# Altium schematic sheet SCH_InfoBar-(ESP8266-12F)_2024-08-24.schdoc
size 602 x 314 mm
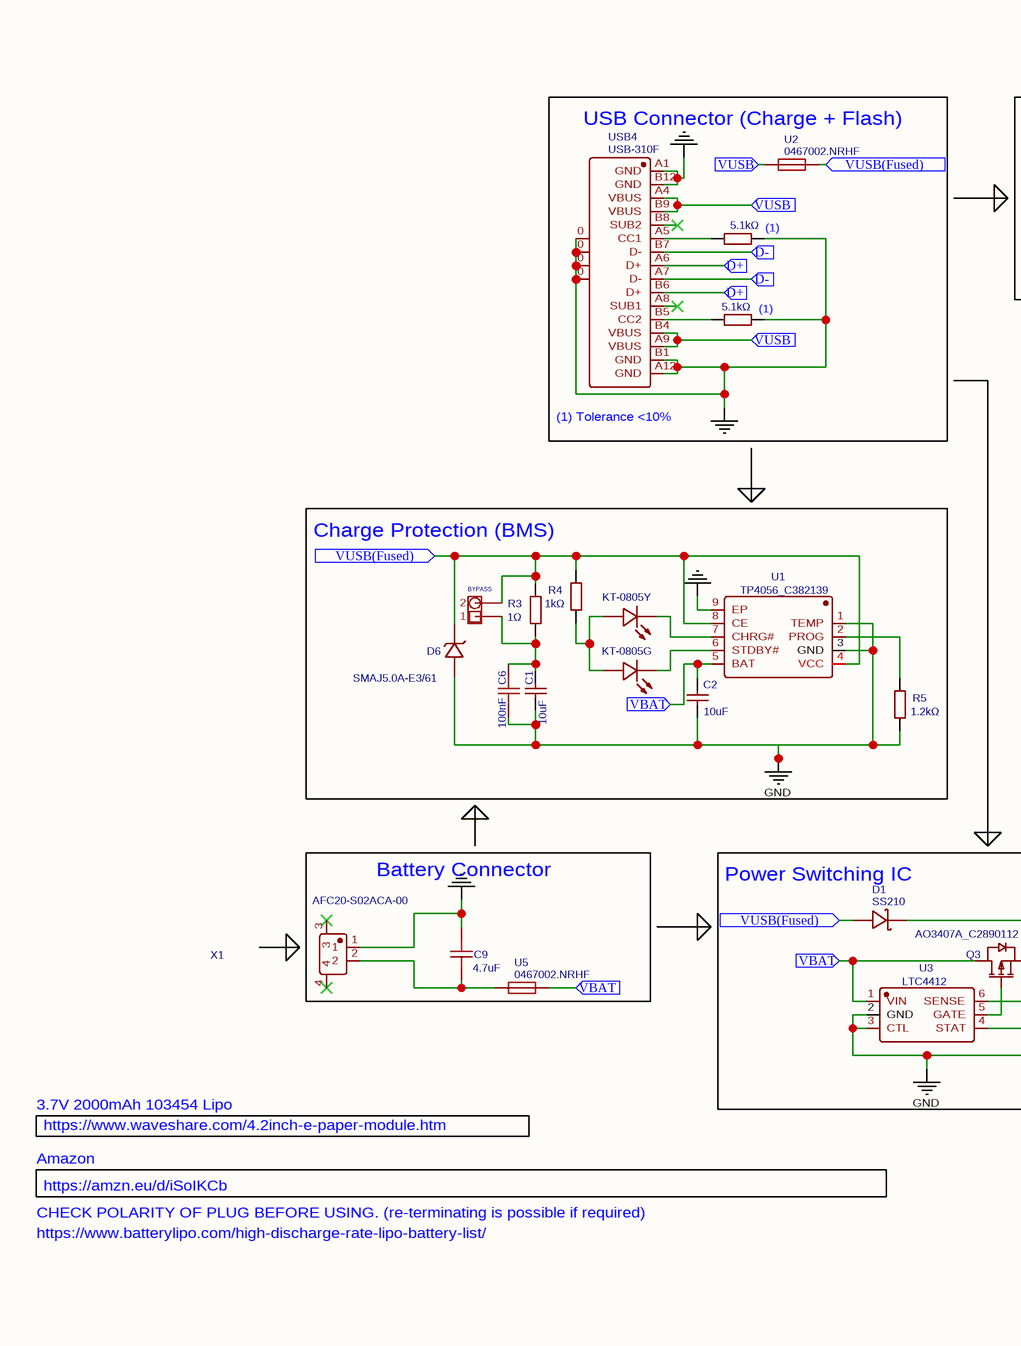
[diagram p0: SCH_InfoBar-(ESP8266-12F)_2024-08-24.schdoc, left]
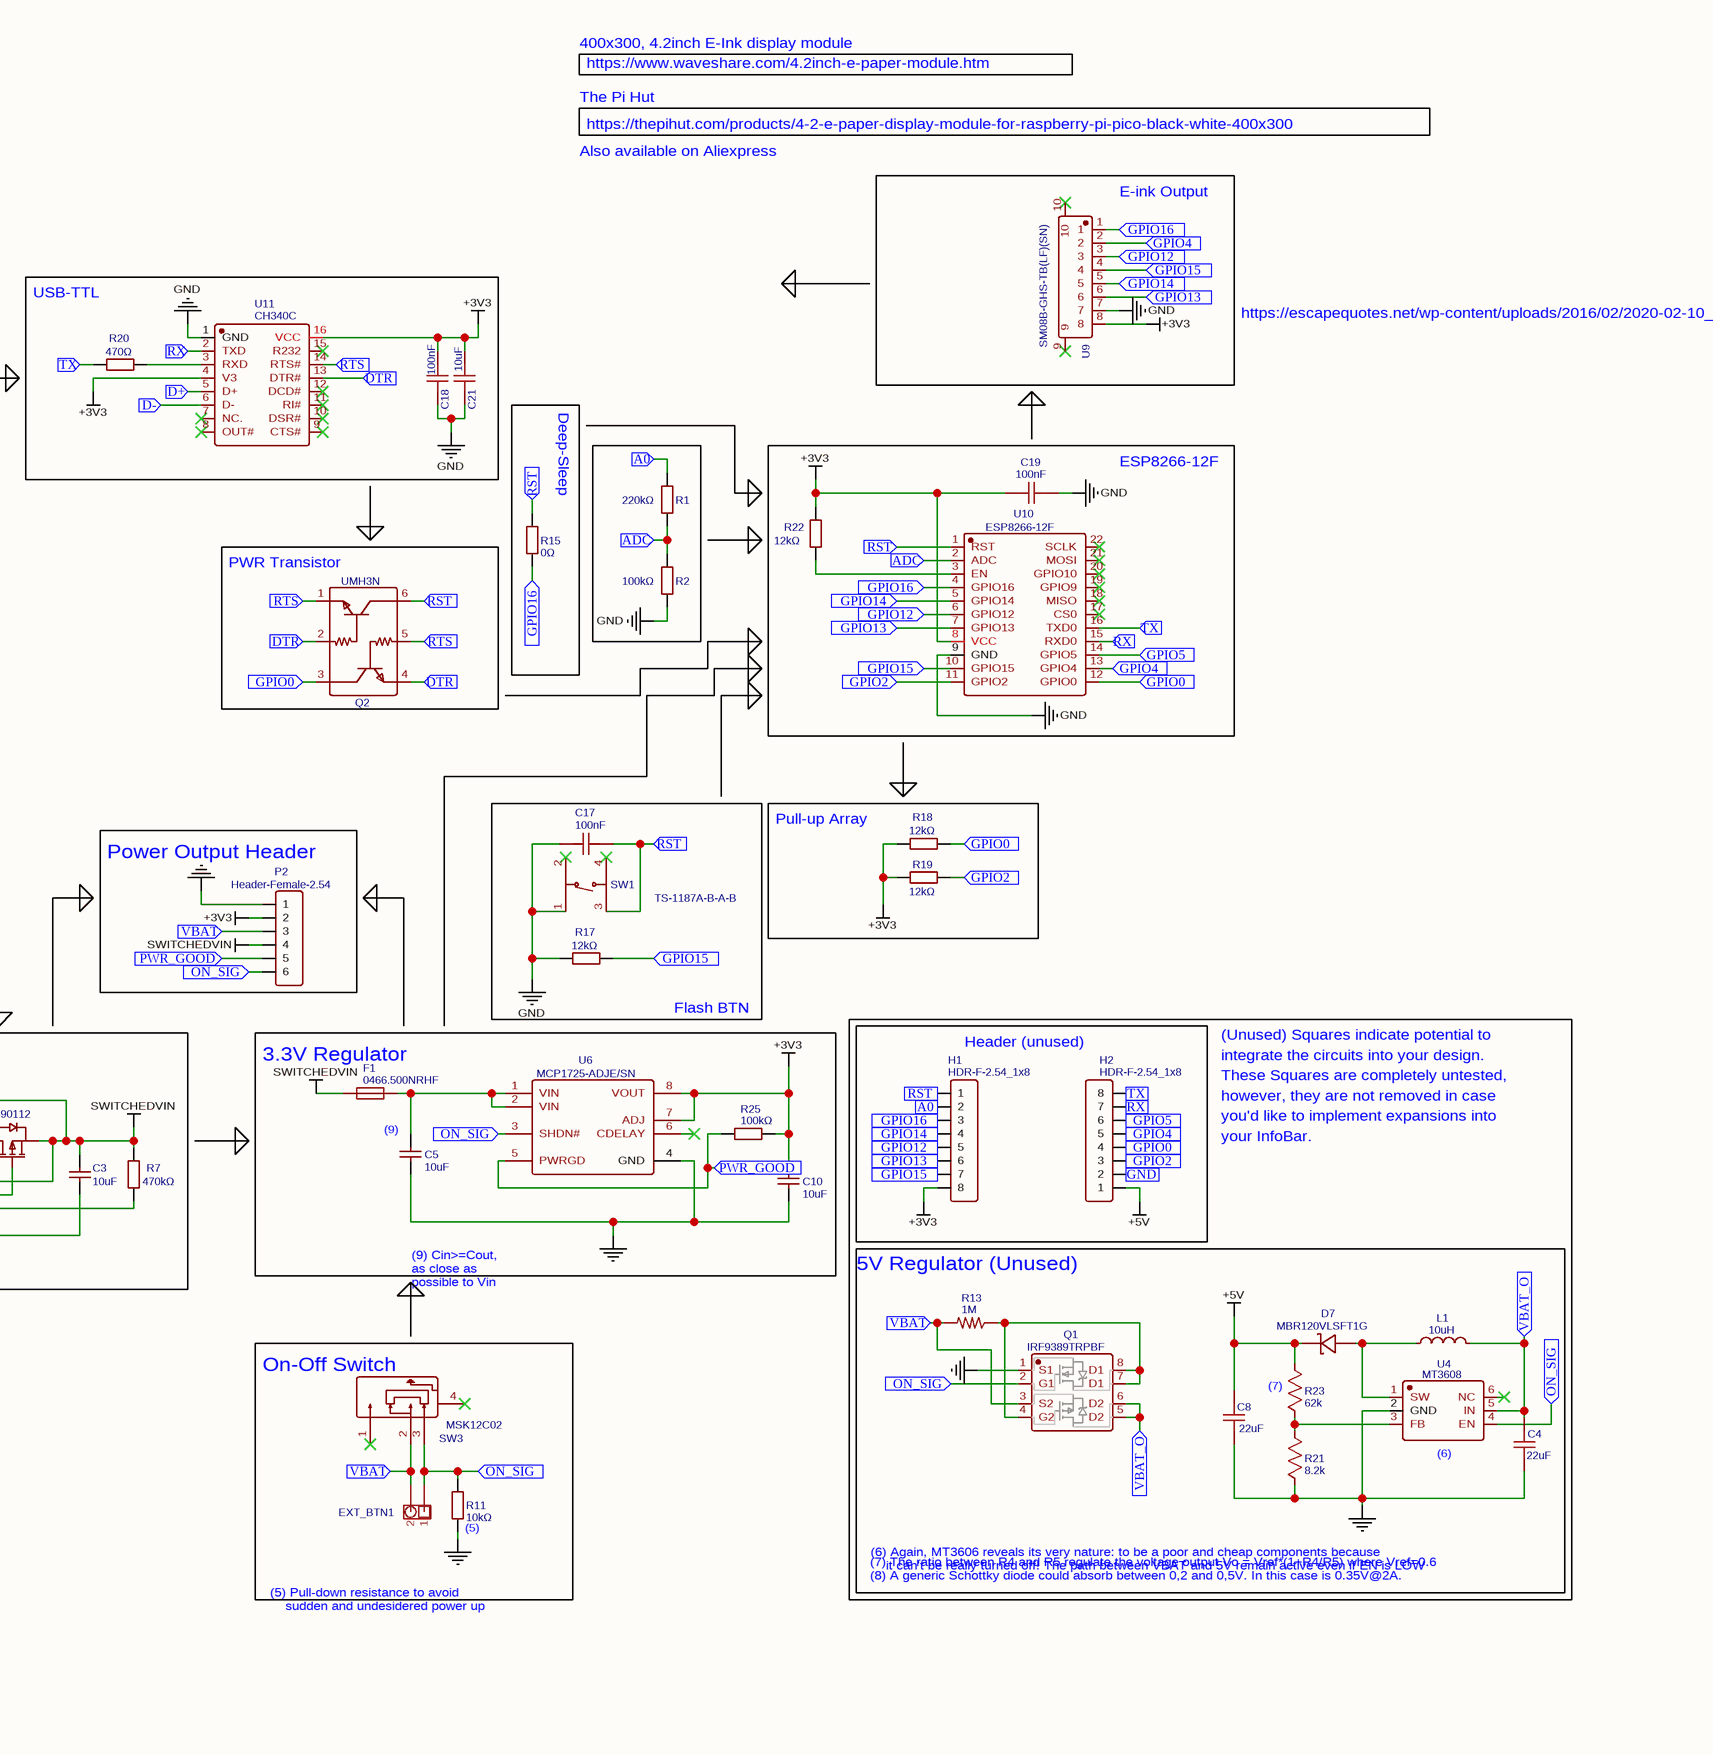
[diagram p1: SCH_InfoBar-(ESP8266-12F)_2024-08-24.schdoc, right]

## Parts
BYPASS  Just a couple of 2.54-spaced pins  [1X02 2.54MM HOLES HEADERS PINS]  (value not drawn)
C1  10uF  [C0402]
C2  10uF  [C0402]
C3  10uF  [C0402]
C4  22uF  [C0603]
C5  10uF  [C0402]
C6  100nF  [C0603]
C8  22uF  [C0603]
C9  4.7uF  [C0603]
C10  10uF  [C0402]
C17  100nF  [C0603]
C18  100nF  [C0603]
C19  100nF  [C0603]
C21  10uF  [C0603]
D1  SS210  [SMA_L4.3-W2.6-LS5.2-RD]
D6  SMAJ5.0A-E3/61  [SMA_L4.3-W2.6-LS5.2-RD]
D7  MBR120VLSFT1G  [SOD-123F_L2.8-W1.8-LS3.7-RD]
EXT_BTN1  Just a couple of 2.54-spaced pins  [1X02 2.54MM HOLES HEADERS PINS]  (value not drawn)
F1  0466.500NRHF  [F1206]
H1  HDR-F-2.54_1x8  [HDR-F-2.54_1X8]
H2  HDR-F-2.54_1x8  [HDR-F-2.54_1X8]
L1  10uH  [L2020]
LED2  KT-0805G  [LED0805-R-RD]
LED3  KT-0805Y  [LED0805-R-RD]
P2  Header-Female-2.54  [HDR-6X1/2.54]
Q1  IRF9389TRPBF  [SOIC-8_L4.9-W3.9-P1.27-LS6.0-BL]
Q2  UMH3N  [SC-70-6_L2.2-W1.3-P0.65-LS2.1-BR]
Q3  AO3407A_C2890112  [SOT-23-3_L2.9-W1.3-P1.90-LS2.4-BR]
R1  220kΩ  [R0603]
R2  100kΩ  [R0603]
R3  1Ω  [R0805]
R4  1kΩ  [R0603]
R5  1.2kΩ  [R0603]
R7  470kΩ  [R0603]
R10  5.1kΩ  [R0402]
R11  10kΩ  [R0603]
R13  1M  [R0603]
R15  0Ω  [R0603]
R17  12kΩ  [R0603]
R18  12kΩ  [R0603]
R19  12kΩ  [R0603]
R20  470Ω  [R0603]
R21  8.2k  [R0603]
R22  12kΩ  [R0603]
R23  62k  [R0603]
R25  100kΩ  [R0603]
R26  5.1kΩ  [R0402]
SW1  TS-1187A-B-A-B  [SW-SMD_4P-L5.1-W5.1-P3.70-LS6.5-TL-2]
SW3  MSK12C02  [SW-TH_MSK12C02]
U1  TP4056_C382139  [ESOP-8_L4.9-W3.9-P1.27-LS6.0-BL-EP]
U2  0467002.NRHF  [F0603]
U3  LTC4412  [SOT-23-6_L2.9-W1.6-P0.95-LS2.8-BL]
U4  MT3608  [SOT-23-6_L2.9-W1.6-P0.95-LS2.8-BR]
U5  0467002.NRHF  [F0603]
U6  MCP1725-ADJE/SN  [SOIC-8_L4.9-W3.9-P1.27-LS6.0-BL]
U9  SM08B-GHS-TB(LF)(SN)  [CONN-SMD_SM08B-GHS-TB-LF-SN]
U10  ESP8266-12F  [WIFIM-SMD_ESP-12F-ESP8266MOD]
U11  CH340C  [SOP-16_L10.0-W3.9-P1.27-LS6.0-BL]
USB4  USB-310F  [USB-C-SMD_20P-P0.50-L6.5-W8.9]
X1  AFC20-S02ACA-00  [CONN-SMD_AFC20-S02ACA-00]

## Blocks framed on the sheet
E-ink Output: U9
USB Connector (Charge + Flash): R10 R26 U2 USB4
USB-TTL: C18 C21 R20 U11
Deep-Sleep: R15
ESP8266-12F: C19 R22 U10
PWR Transistor: Q2
Charge Protection (BMS): BYPASS C1 C2 C6 D6 LED2 LED3 R3-R5 U1
Flash BTN: C17 R17 SW1
Pull-up Array: R18 R19
Power Output Header: P2
Battery Connector: C9 U5 X1
Power Switching IC: C3 D1 Q3 R7 U3
3.3V Regulator: C5 C10 F1 R25 U6
Header (unused): H1 H2
5V Regulator (Unused): C4 C8 D7 L1 Q1 R13 R21 R23 U4
On-Off Switch: EXT_BTN1 R11 SW3

## Ports
A0 (in), ADC (in), D+ (in), D- (in), DTR (in), GND (in), GPIO0 (in), GPIO2 (in), GPIO4 (in), GPIO5 (in), GPIO12 (in), GPIO13 (in), GPIO14 (in), GPIO15 (in), GPIO16 (in), ON_SIG (in), PWR_GOOD (in), RST (in), RTS (in), RX (in), TX (in), VBAT (in), VBAT_O (in), VUSB (in), VUSB(Fused) (in)

## Nets
+3V3: C10.1 C18.2 C19.2 C21.1 H1.8 P2.2 R18.1 R19.1 R22.2 R25.2 U6.7(ADJ) U6.8(VOUT) U9.8 U10.8(VCC) U11.4(V3) U11.16(VCC)
+5V: C8.2 D7.1(K) H2.1 R23.2
GND: C1.2 C2.2 C3.2 C4.1 C5.2 C6.2 C8.1 C9.1 C10.2 C17.2 C18.1 C19.1 C21.2 D6.2(A) P2.1 Q1.1(S1) R2.2 R5.2 R10.2 R11.1 R17.1 R21.1 R26.2 SW1.1(A) U1.1(TEMP) U1.3(GND) U1.9(EP) U3.2(GND) U3.3(CTL) U4.2(GND) U6.4(GND) U9.7 U10.9(GND) U11.1(GND) USB4.0 USB4.A1(GND) USB4.A12(GND) USB4.B1(GND) USB4.B12(GND) X1.1
SWITCHEDVIN: C3.1 D1.1(K) F1.1 P2.4 Q3.2(S) R7.2 U3.6(SENSE)
A0: H1.2 R1.1 ; port A0
ADC: R1.2 R2.1 U10.2(ADC) ; port ADC
D+: U11.5(D+) USB4.A6(D+) USB4.B6(D+) ; port D+
D-: U11.6(D-) USB4.A7(D-) USB4.B7(D-) ; port D-
DTR: Q2.2(B) Q2.4(E) U11.13(DTR#) ; port DTR
GND: H2.2 ; port GND  [a separate net that carries the same name]
GPIO0: H2.4 Q2.3(C) R18.2 U10.12(GPIO0) ; port GPIO0
GPIO2: H2.3 R19.2 U10.11(GPIO2) ; port GPIO2
GPIO4: H2.5 U9.2 U10.13(GPIO4) ; port GPIO4
GPIO5: H2.6 U10.14(GPIO5) ; port GPIO5
GPIO12: H1.5 U9.3 U10.6(GPIO12) ; port GPIO12
GPIO13: H1.6 U9.6 U10.7(GPIO13) ; port GPIO13
GPIO14: H1.4 U9.5 U10.5(GPIO14) ; port GPIO14
GPIO15: H1.7 R17.2 U9.4 U10.10(GPIO15) ; port GPIO15
GPIO16: H1.3 R15.2 U9.1 U10.4(GPIO16) ; port GPIO16
ON_SIG: EXT_BTN1.1 P2.6 Q1.2(G1) R11.2 SW3.3 U4.4(EN) U6.3(SHDN#) ; port ON_SIG
PWR_GOOD: P2.5 R25.1 U6.5(PWRGD) ; port PWR_GOOD
RST: C17.1 H1.1 Q2.6(C) R15.1 SW1.3(C) U10.1(RST) ; port RST
RTS: Q2.1(E) Q2.5(B) U11.14(RTS#) ; port RTS
RX: H2.7 U10.15(RXD0) U11.2(TXD) ; port RX
TX: H2.8 R20.1 U10.16(TXD0) ; port TX
VBAT: C2.1 EXT_BTN1.2 P2.3 Q1.3(S2) Q3.3(D) R13.2 SW3.2 U1.5(BAT) U3.1(VIN) U5.2 ; port VBAT
VBAT_O: C4.2 L1.2 Q1.5(D2) Q1.6(D2) U4.5(IN) ; port VBAT_O
VUSB: U2.1 USB4.A4(VBUS) USB4.A9(VBUS) USB4.B4(VBUS) USB4.B9(VBUS) ; port VUSB
VUSB(Fused): BYPASS.2 D1.2(A) D6.1(C) R3.1 R4.2 U1.4(VCC) U1.8(CE) U2.2 ; port VUSB(Fused)
NetBYPASS_1: BYPASS.1 C1.1 C6.1 R3.2
NetC5_1: C5.1 F1.2 U6.1(VIN) U6.2(VIN)
NetC9_2: C9.2 U5.1 X1.2
NetD7_2: D7.2(A) L1.1 U4.1(SW)
NetLED2_1: LED2.1(A) LED3.1(+) R4.1
NetLED2_2: LED2.2(K) U1.6(STDBY#)
NetLED3_2: LED3.2(-) U1.7(CHRG#)
NetQ1_4: Q1.4(G2) Q1.7(D1) Q1.8(D1) R13.1
NetQ3_1: Q3.1(G) U3.5(GATE)
NetR5_1: R5.1 U1.2(PROG)
NetR7_1: R7.1 U3.4(STAT)
NetR10_1: R10.1 USB4.B5(CC2)
NetR20_2: R20.2 U11.3(RXD)
NetR21_2: R21.2 R23.1 U4.3(FB)
NetR22_1: R22.1 U10.3(EN)
NetR26_1: R26.1 USB4.A5(CC1)

Not connected (* = marked no-connect by the designer): SW1 2(B)* 4(D)*; SW3 1* 4*; U4 6(NC)*; U6 6(CDELAY)*; U9 9* 10*; U10 17(CS0)* 18(MISO)* 19(GPIO9)* 20(GPIO10)* 21(MOSI)* 22(SCLK)*; U11 7(NC.)* 8(OUT#)* 9(CTS#)* 10(DSR#)* 11(RI#)* 12(DCD#)* 15(R232)*; USB4 A8(SUB1)* B8(SUB2)*; X1 3* 4*

## Notes on the sheet
- 400x300, 4.2inch E-Ink display module
- The Pi Hut
- https://www.waveshare.com/4.2inch-e-paper-module.htm
- https://thepihut.com/products/4-2-e-paper-display-module-for-raspberry-pi-pico-black-white-400x300
- Also available on Aliexpress
- https://escapequotes.net/wp-content/uploads/2016/02/2020-02-10_12-06-36.jpg
- (near R26) (1)
- (near R10) (1)
- (near USB4) (1) Tolerance <10%
- (Unused) Squares indicate potential to
- integrate the circuits into your design.
- (near C5) (9)
- These Squares are completely untested,
- however, they are not removed in case
- you'd like to implement expansions into
- your InfoBar.
- (near SW3) (9) Cin>=Cout,
  as close as
  possible to Vin
- Amazon
- 3.7V 2000mAh 103454 Lipo
- CHECK POLARITY OF PLUG BEFORE USING. (re-terminating is possible if required)
- https://amzn.eu/d/iSoIKCb
- (near R23) (7)
- https://www.batterylipo.com/high-discharge-rate-lipo-battery-list/
- (near U4) (6)
- (near R11) (5)
- (6) Again, MT3606 reveals its very nature: to be a poor and cheap components because
  it can't be really turned off! The path between VBAT and 5V remain active even if EN is LOW
- (5) Pull-down resistance to avoid
  sudden and undesidered power up
- (7) The ratio between R4 and R5 regulate the voltage output Vo = Vref*(1+R4/R5) where Vref=0.6
- (8) A generic Schottky diode could absorb between 0,2 and 0,5V. In this case is 0.35V@2A.

## Library data of the parts
BYPASS EXT_BTN1 = Just a couple of 2.54-spaced pins: Contributor: fabiano.riccardi; Manufacturer Part: ?; spicePre: J
C1-C3 C5 C10 = 10uF: Manufacturer Part: CL05A106MQ5NUNC; Manufacturer: SAMSUNG(三星); nameAlias: Value; Supplier: LCSC; Supplier Part: C15525; JLCPCB Part Class: Basic Part; spicePre: C; spiceSymbolName: CL05A106MQ5NUNC
C4 C8 = 22uF: nameAlias: Value(F); Manufacturer Part: ?; spicePre: C; spiceSymbolName: Cap_RAD-0.1_US
C6 C17-C19 = 100nF: Manufacturer: YAGEO(国巨); Manufacturer Part: CC0603KRX7R9BB104; nameAlias: Value; Supplier: LCSC; Supplier Part: C14663; JLCPCB Part Class: Basic Part; spicePre: C; spiceSymbolName: CC0603KRX7R9BB104
C9 = 4.7uF: nameAlias: Value(F); Manufacturer Part: ?; spicePre: C; spiceSymbolName: Cap_RAD-0.1_US
C21 = 10uF: Manufacturer: SAMSUNG(三星); Manufacturer Part: CL10A106KP8NNNC; nameAlias: Value; Supplier: LCSC; Supplier Part: C19702; JLCPCB Part Class: Basic Part; spicePre: C; spiceSymbolName: CL10A106KP8NNNC
D1 = SS210: Manufacturer: MDD(辰达半导体); Supplier: LCSC; Manufacturer Part: SS210; Supplier Part: C14996; JLCPCB Part Class: Basic Part; spicePre: D; spiceSymbolName: SS210
D6 = SMAJ5.0A-E3/61: Manufacturer: VISHAY(威世); Supplier: LCSC; Manufacturer Part: SMAJ5.0A-E3/61; Supplier Part: C89363; JLCPCB Part Class: Extended Part; spicePre: D; spiceSymbolName: SMAJ5.0A-E3/61
D7 = MBR120VLSFT1G: Manufacturer: ON Semicon; Contributor: LCSC; SMT Type: Extend; Supplier: LCSC; Supplier Part: C223608; Manufacturer Part: MBR120VLSFT1G; LCSC Assembly: Yes; spicePre: D; spiceSymbolName: MBR120VLSFT1G
F1 = 0466.500NRHF: Manufacturer: Littelfuse(美国力特); Contributor: LCSC; Supplier: LCSC; Supplier Part: C151133; Manufacturer Part: 0466.500NRHF; JLCPCB Part Class: Extended Part; spicePre: F; spiceSymbolName: 0466.500NRHF
H1 H2 = HDR-F-2.54_1x8: Contributor: LCEDA_Lib; Supplier Part: C225505; Supplier: LCSC; spicePre: H; spiceSymbolName: HDR-F-2.54_1x8
L1 = 10uH: Manufacturer: Murata Electronics; Manufacturer Part: LQH5BPN100M38L; nameAlias: Inductance; Contributor: LCSC; Supplier: LCSC; Supplier Part: C237555; spicePre: L; spiceSymbolName: LQH5BPN100M38L
LED2 = KT-0805G: Manufacturer: KENTO; Supplier: LCSC; Manufacturer Part: KT-0805G; Supplier Part: C2297; JLCPCB Part Class: Basic Part; spicePre: L; spiceSymbolName: 0805G (Green)
LED3 = KT-0805Y: Manufacturer: KENTO; Manufacturer Part: KT-0805黄灯; Supplier: LCSC; Supplier Part: C2296; JLCPCB Part Class: Basic Part; spicePre: L; spiceSymbolName: 17-21SUYC/TR8
P2 = Header-Female-2.54: Manufacturer: BOOMELE; Manufacturer Part: Female header 1*6p; Supplier: LCSC; Supplier Part: C40877; spicePre: P
Q1 = IRF9389TRPBF: Manufacturer: Infineon; Contributor: LCSC; Supplier: LCSC; Manufacturer Part: IRF9389TRPBF; Supplier Part: C152654; spicePre: Q; spiceSymbolName: IRF9389TRPBF detailed
Q2 = UMH3N: Manufacturer: CJ(江苏长电/长晶); Supplier: LCSC; Manufacturer Part: UMH3N; Supplier Part: C62892; JLCPCB Part Class: Extended Part; spicePre: Q; spiceSymbolName: UMH3N
Q3 = AO3407A_C2890112: Manufacturer: TECH PUBLIC(台舟); Contributor: LCSC; Supplier: LCSC; Supplier Part: C2890112; Manufacturer Part: AO3407A; JLCPCB Part Class: Extended Part; spicePre: Q; spiceSymbolName: AO3407A_C2890112
R1 = 220kΩ: Manufacturer: UNI-ROYAL(厚声); Manufacturer Part: 0603WAF2203T5E; nameAlias: Value; Supplier: LCSC; Supplier Part: C22961; JLCPCB Part Class: Basic Part; spicePre: R; spiceSymbolName: 0603WAF2203T5E
R2 R25 = 100kΩ: Manufacturer: UNI-ROYAL(厚声); Manufacturer Part: 0603WAF1003T5E; nameAlias: Value; Supplier: LCSC; Supplier Part: C25803; JLCPCB Part Class: Basic Part; spicePre: R; spiceSymbolName: 0603WAF1003T5E
R3 = 1Ω: Manufacturer: UNI-ROYAL(厚声); Manufacturer Part: 0805W8F100KT5E; nameAlias: Value; Supplier: LCSC; Supplier Part: C25271; JLCPCB Part Class: Basic Part; spicePre: R; spiceSymbolName: 0805W8F100KT5E
R4 = 1kΩ: Manufacturer: UNI-ROYAL(厚声); Manufacturer Part: 0603WAF1001T5E; nameAlias: Value; Supplier: LCSC; Supplier Part: C21190; JLCPCB Part Class: Basic Part; spicePre: R; spiceSymbolName: 0603WAF1001T5E
R5 = 1.2kΩ: Manufacturer: UNI-ROYAL(厚声); Manufacturer Part: 0603WAF1201T5E; nameAlias: Value; Supplier: LCSC; Supplier Part: C22765; JLCPCB Part Class: Basic Part; spicePre: R; spiceSymbolName: 0603WAF1201T5E
R7 = 470kΩ: Manufacturer: UNI-ROYAL(厚声); Manufacturer Part: 0603WAF4703T5E; nameAlias: Value; Supplier: LCSC; Supplier Part: C23178; JLCPCB Part Class: Basic Part; spicePre: R; spiceSymbolName: 0603WAF4703T5E
R10 R26 = 5.1kΩ: Manufacturer: UNI-ROYAL(厚声); Manufacturer Part: 0402WGF5101TCE; nameAlias: Value; Supplier: LCSC; Supplier Part: C25905; JLCPCB Part Class: Basic Part; spicePre: R; spiceSymbolName: 0402WGF5101TCE
R11 = 10kΩ: Manufacturer: UNI-ROYAL(厚声); Manufacturer Part: 0603WAF1002T5E; nameAlias: Value; Supplier: LCSC; Supplier Part: C25804; JLCPCB Part Class: Basic Part; spicePre: R; spiceSymbolName: 0603WAF1002T5E
R15 = 0Ω: Manufacturer: UNI-ROYAL(厚声); Manufacturer Part: 0603WAF0000T5E; nameAlias: Value; Supplier: LCSC; Supplier Part: C21189; JLCPCB Part Class: Basic Part; spicePre: R; spiceSymbolName: 0603WAF0000T5E
R17-R19 R22 = 12kΩ: Manufacturer: UNI-ROYAL(厚声); Manufacturer Part: 0603WAF1202T5E; nameAlias: Value; Supplier: LCSC; Supplier Part: C22790; JLCPCB Part Class: Basic Part; spicePre: R; spiceSymbolName: 0603WAF1202T5E
R20 = 470Ω: Manufacturer: UNI-ROYAL(厚声); Manufacturer Part: 0603WAF4700T5E; nameAlias: Value; Supplier: LCSC; Supplier Part: C23179; JLCPCB Part Class: Basic Part; spicePre: R; spiceSymbolName: 0603WAF4700T5E
R21 = 8.2k: nameAlias: Value(Ω); Manufacturer Part: ?; spicePre: R; spiceSymbolName: Res_AXIAL-0.3(1/8W)_US
R23 = 62k: nameAlias: Value(Ω); Manufacturer Part: ?; spicePre: R; spiceSymbolName: Res_AXIAL-0.3(1/8W)_US
SW1 = TS-1187A-B-A-B: Manufacturer: XKB Connectivity(中国星坤); Contributor: LCSC; Supplier: LCSC; Supplier Part: C318884; Manufacturer Part: TS-1187A-B-A-B; JLCPCB Part Class: Basic Part; spicePre: S; spiceSymbolName: TS-1187A-B-A-B
SW3 = MSK12C02: Manufacturer: SHOU HAN(首韩); Contributor: LCSC; Supplier: LCSC; Supplier Part: C431540; Manufacturer Part: MSK12C02; JLCPCB Part Class: Extended Part; spicePre: S; spiceSymbolName: MSK12C02
U1 = TP4056_C382139: Manufacturer: TPOWER(天源); Manufacturer Part: TP4056; Contributor: LCSC; Supplier: LCSC; Supplier Part: C382139; JLCPCB Part Class: Extended Part; spicePre: U; spiceSymbolName: TP4056_C382139
U2 U5 = 0467002.NRHF: Manufacturer: Littelfuse(美国力特); Contributor: LCSC; Supplier: LCSC; Supplier Part: C187605; Manufacturer Part: 0467002.NRHF; JLCPCB Part Class: Extended Part; spicePre: U; spiceSymbolName: 0467002.NRHF
U3 = LTC4412: Manufacturer: ADI(亚德诺); Manufacturer Part: LTC4412IS6#TRPBF; Contributor: LCSC; Supplier: LCSC; Supplier Part: C521306; JLCPCB Part Class: Extended Part; spicePre: U; spiceSymbolName: LTC4412IS6#TRPBF_C521306
U4 = MT3608: Manufacturer: AEROSEMI; SMT Type: Extend; Supplier: LCSC; Manufacturer Part: MT3608; Supplier Part: C84817; JLCPCB SMD: Yes; spicePre: U; spiceSymbolName: MT3608
U6 = MCP1725-ADJE/SN: Manufacturer: MICROCHIP(美国微芯); Contributor: LCSC; Supplier: LCSC; Manufacturer Part: MCP1725-ADJE/SN; Supplier Part: C148041; JLCPCB Part Class: Extended Part; spicePre: U; spiceSymbolName: MCP1725-ADJE/SN
U9 = SM08B-GHS-TB(LF)(SN): Manufacturer: JST; Contributor: LCSC; Supplier: LCSC; Supplier Part: C265111; Manufacturer Part: SM08B-GHS-TB(LF)(SN); JLCPCB Part Class: Extended Part; spicePre: U; spiceSymbolName: SM08B-GHS-TB(LF)(SN)
U10 = ESP8266-12F: Manufacturer: Ai-Thinker(安信可); Manufacturer Part: ESP-12F(ESP8266MOD); nameAlias: Value; Supplier: LCSC; Supplier Part: C82891; JLCPCB Part Class: Extended Part; spicePre: U; spiceSymbolName: ESP-12F(ESP8266MOD)
U11 = CH340C: Manufacturer: WCH(南京沁恒); Supplier: LCSC; Manufacturer Part: CH340C; Supplier Part: C84681; JLCPCB Part Class: Extended Part; spicePre: U; spiceSymbolName: CH340C
USB4 = USB-310F: Manufacturer: HOOYA(皓宇电子); Manufacturer Part: USB-310F-B-SU; Contributor: LCSC; Supplier: LCSC; Supplier Part: C309365; JLCPCB Part Class: Extended Part; spicePre: U; spiceSymbolName: USB-310F
X1 = AFC20-S02ACA-00: Manufacturer: JS(钜硕电子); Contributor: LCSC; Supplier: LCSC; Supplier Part: C2764211; Manufacturer Part: AFC20-S02ACA-00; JLCPCB Part Class: Extended Part; spicePre: X; spiceSymbolName: AFC20-S02ACA-00